# EAGLE schematic MSSRP-Bluetooth_IF (EAGLE 6.6.0)
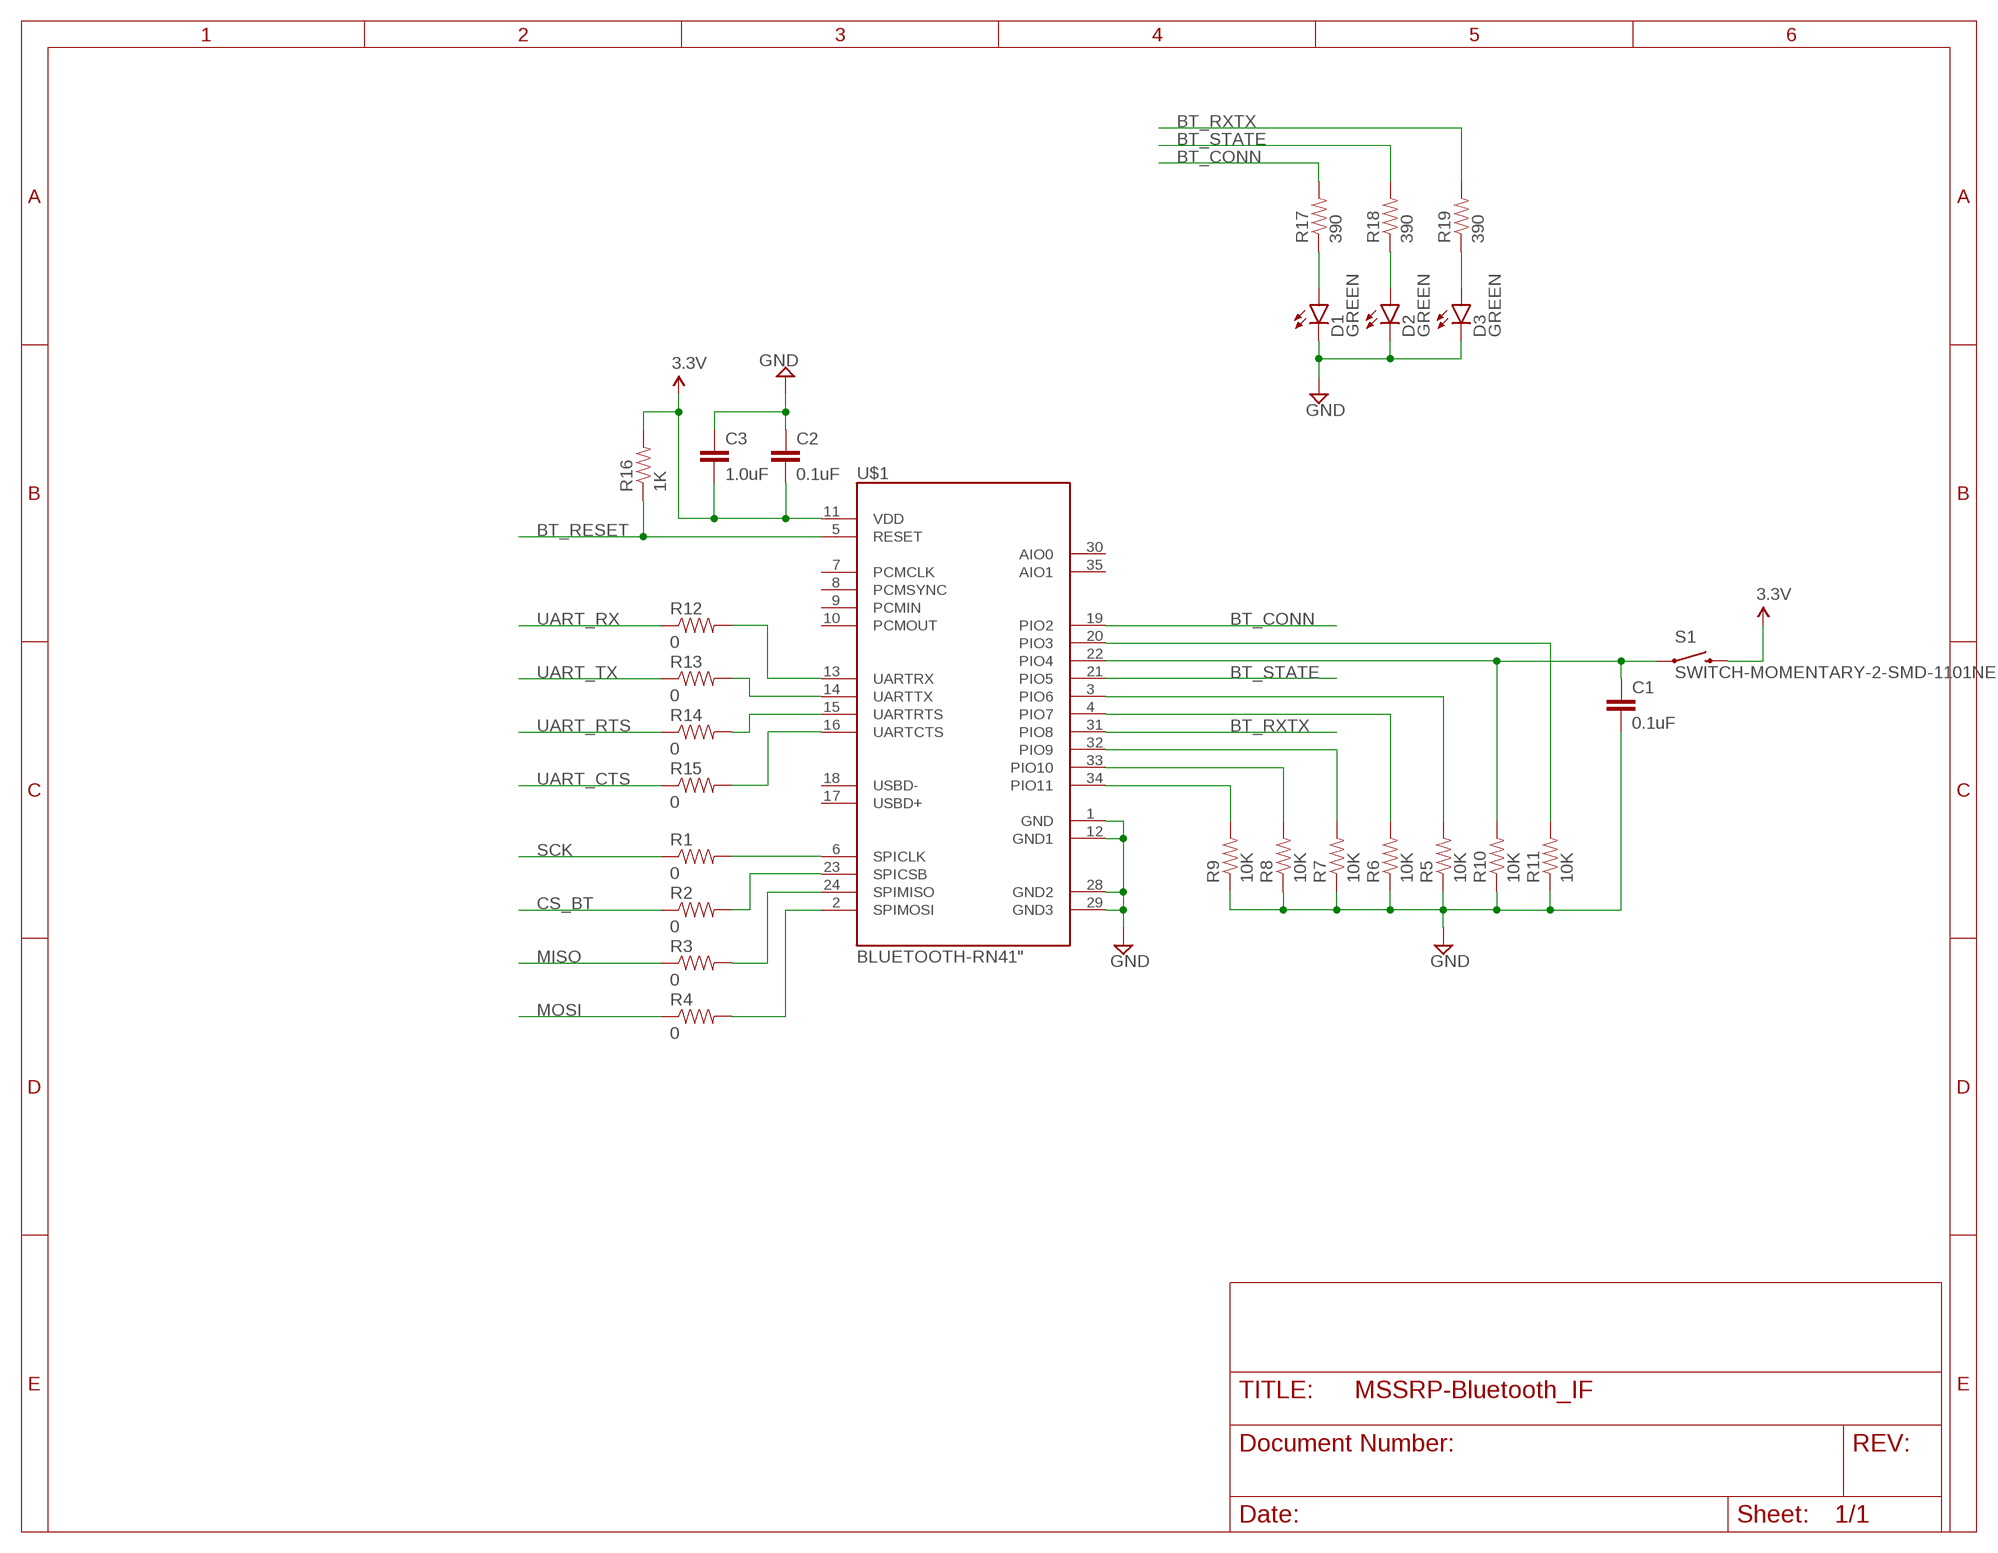
[diagram p0: schematic, sheet 1]

## Parts
C1  0.1uF  0.1UF-25V-5%(0603)  [0603-CAP]
C2  0.1uF  0.1UF-25V-5%(0603)  [0603-CAP]
C3  1.0uF  1.0UF-16V-10%(0603)  [0603-CAP]
D1  GREEN  LED-GREEN0603  [LED-0603]
D2  GREEN  LED-GREEN0603  [LED-0603]
D3  GREEN  LED-GREEN0603  [LED-0603]
R1  0  0OHM1/10W5%(0603)  [0603]
R2  0  0OHM1/10W5%(0603)  [0603]
R3  0  0OHM1/10W5%(0603)  [0603]
R4  0  0OHM1/10W5%(0603)  [0603]
R5  10K  10KOHM1/10W1%(0603)0603  [0603-RES]
R6  10K  10KOHM1/10W1%(0603)0603  [0603-RES]
R7  10K  10KOHM1/10W1%(0603)0603  [0603-RES]
R8  10K  10KOHM1/10W1%(0603)0603  [0603-RES]
R9  10K  10KOHM1/10W1%(0603)0603  [0603-RES]
R10  10K  10KOHM1/10W1%(0603)0603  [0603-RES]
R11  10K  10KOHM1/10W1%(0603)0603  [0603-RES]
R12  0  0OHM1/10W5%(0603)  [0603]
R13  0  0OHM1/10W5%(0603)  [0603]
R14  0  0OHM1/10W5%(0603)  [0603]
R15  0  0OHM1/10W5%(0603)  [0603]
R16  1K  1KOHM1/10W1%(0603)  [0603-RES]
R17  390  390OHM1/10W1%(0603)  [0603-RES]
R18  390  390OHM1/10W1%(0603)  [0603-RES]
R19  390  390OHM1/10W1%(0603)  [0603-RES]
S1  SWITCH-MOMENTARY-2-SMD-1101NE  [TACTILE-SWITCH-1101NE]
U$1  BLUETOOTH-RN41"  [RN41]

## Nets
3.3V: C2.2 C3.2 R16.2 S1.P$2 U$1.11(VDD)
BT_CONN: R17.2 U$1.19(PIO2)
BT_RESET: R16.1 U$1.5(RESET)
BT_RXTX: R19.2 U$1.31(PIO8)
BT_STATE: R18.2 U$1.21(PIO5)
CS_BT: R2.1
GND: C1.2 C2.1 C3.1 D1.C D2.C D3.C R5.1 R6.1 R7.1 R8.1 R9.1 R10.1 R11.1 U$1.1(GND) U$1.12(GND1) U$1.28(GND2) U$1.29(GND3)
MISO: R3.1
MOSI: R4.1
N$1: R1.2 U$1.6(SPICLK)
N$2: R2.2 U$1.23(SPICSB)
N$3: R3.2 U$1.24(SPIMISO)
N$4: R4.2 U$1.2(SPIMOSI)
N$5: R6.2 U$1.4(PIO7)
N$6: R5.2 U$1.3(PIO6)
N$7: R7.2 U$1.32(PIO9)
N$8: R8.2 U$1.33(PIO10)
N$9: R9.2 U$1.34(PIO11)
N$10: R11.2 U$1.20(PIO3)
N$11: C1.1 R10.2 S1.P$1 U$1.22(PIO4)
N$14: D1.A R17.1
N$15: D2.A R18.1
N$16: R13.2 U$1.14(UARTTX)
N$17: R14.2 U$1.15(UARTRTS)
N$18: R15.2 U$1.16(UARTCTS)
N$19: R12.2 U$1.13(UARTRX)
N$20: D3.A R19.1
SCK: R1.1
UART_CTS: R15.1
UART_RTS: R14.1
UART_RX: R12.1
UART_TX: R13.1
Unconnected: U$1.7(PCMCLK) U$1.8(PCMSYNC) U$1.9(PCMIN) U$1.10(PCMOUT) U$1.17(USBD+) U$1.18(USBD-) U$1.30(AIO0) U$1.35(AIO1)

## Library data of the parts
C1 C2 = SparkFun-Capacitors:0.1UF-25V-5%(0603): CAP-08604; PROD_ID: CAP-08604
C3 = SparkFun-Capacitors:1.0UF-16V-10%(0603): CAP-00868; PROD_ID: CAP-00868
D1-D3 = SparkFun-LED:LED-GREEN: Various green LEDs Green LEDs used in SFE Production 0603- DIO-00821 LARGE- DIO-00862 LILYPAD- DIO-09910; PROD_ID: DIO-00821
R1-R4 R12-R15 = SparkFun-Resistors:0OHM1/10W5%(0603): RES-08609; PROD_ID: RES-08609
R5-R11 = SparkFun-Resistors:10KOHM1/10W1%(0603): RES-00824; PROD_ID: RES-00824
R16 = SparkFun-Resistors:1KOHM1/10W1%(0603): RES-07856; PROD_ID: RES-07856
R17-R19 = SparkFun-Resistors:390OHM1/10W1%(0603): RES-07864; PROD_ID: RES-07864
S1 = SparkFun-Electromechanical:SWITCH-MOMENTARY-2: Various NO switches- pushbuttons, reed, etc
U$1 = SparkFun-RF:BLUETOOTH-RN41: Bluetooth SMD module